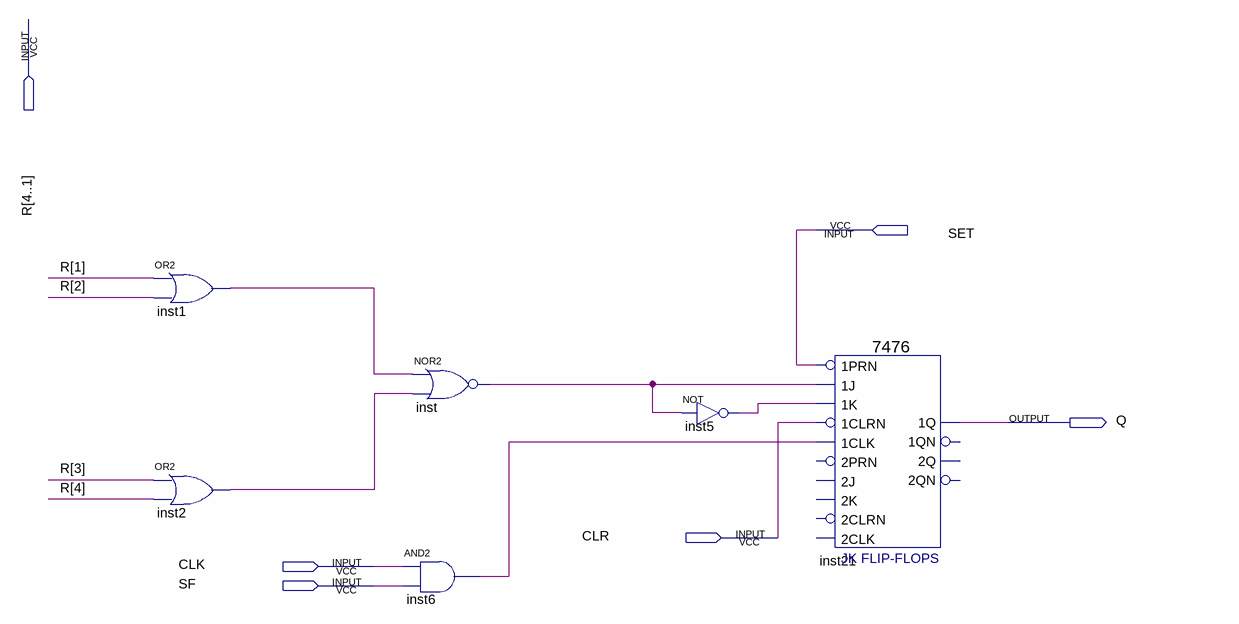
[diagram p0: schematic sheet]
// Quartus schematic Flag.bdf as structural Verilog: 6 symbols, 6 pins
module Flag (
  input  [4:1] R,
  input  SET,
  input  CLR,
  input  CLK,
  input  SF,
  output Q
);

  wire inst1_out, inst2_out, inst5_out, inst6_out, inst_out;

  or inst1 (inst1_out, R[1], R[2]);
  or inst2 (inst2_out, R[3], R[4]);
  nor inst (inst_out, inst1_out, inst2_out);
  and inst6 (inst6_out, CLK, SF);
  not inst5 (inst5_out, inst_out);
  \7476  inst21 (
    .\1J (inst_out), .\1K (inst5_out), .\1PRN (SET), .\1CLK (inst6_out), .\1CLRN (CLR), .\1Q (Q));  // open: 2PRN, 2J, 2K, 2CLRN, 2CLK, 2QN, 2Q, 1QN
endmodule
